# Altium schematic sheet Controllable_voltage_outputs.SchDoc
size A4; SheetNumber: 5; SheetTotal: 6
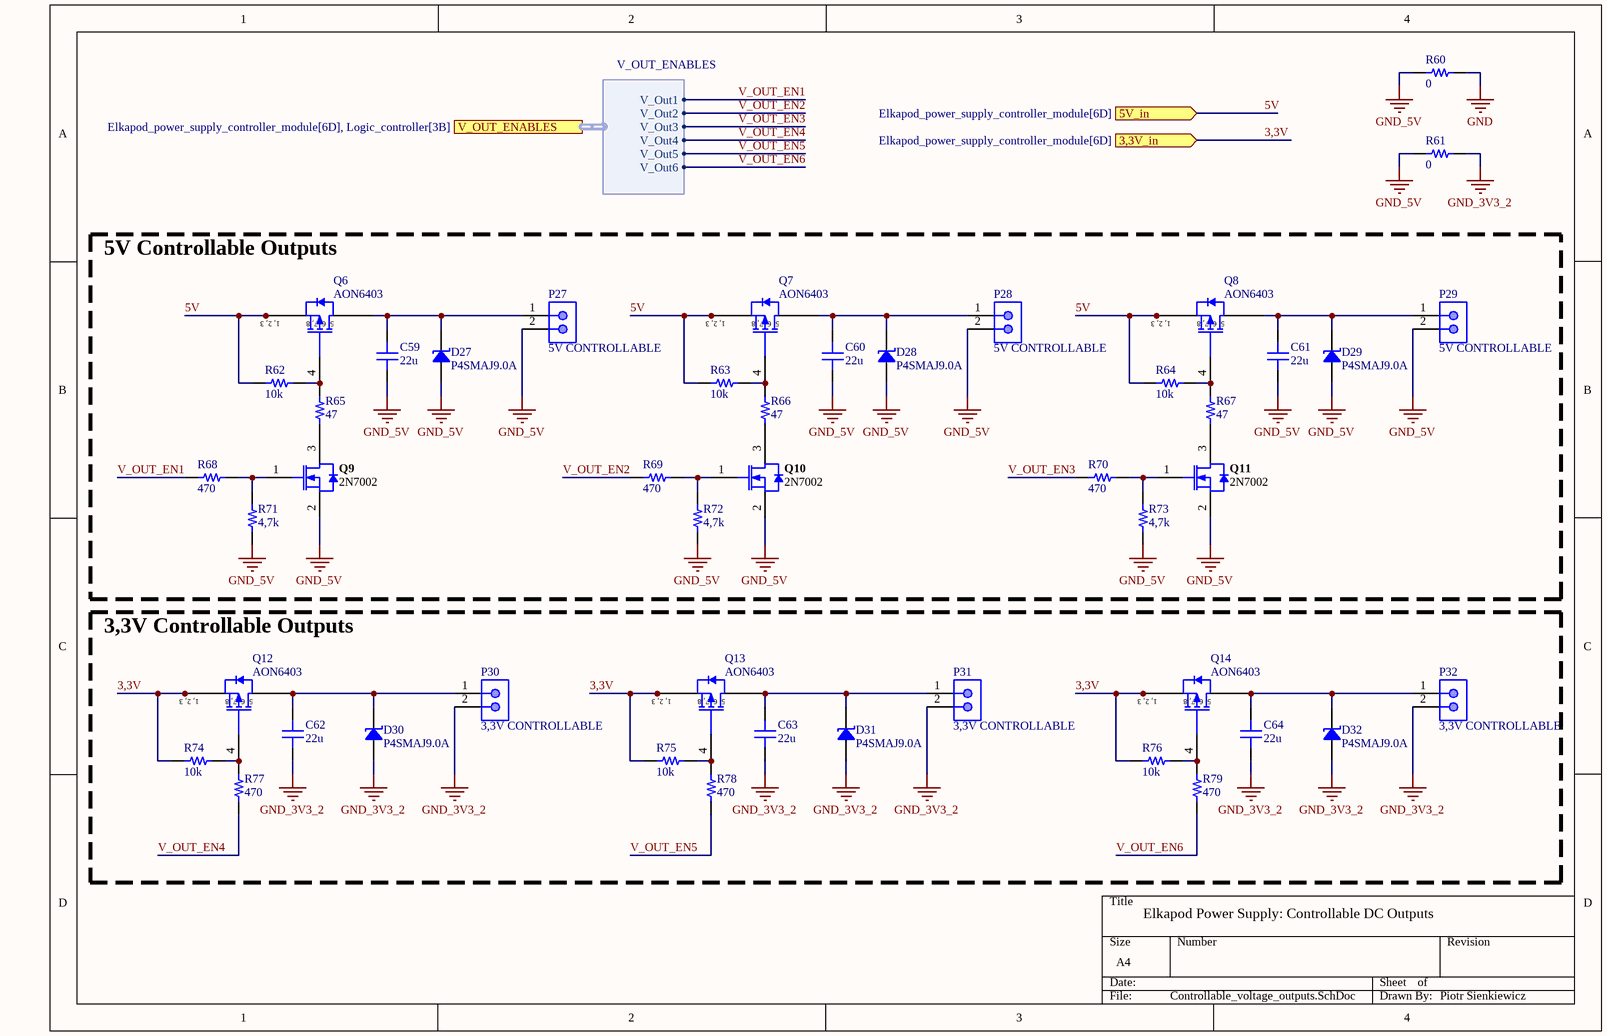
[diagram p0: Controllable_voltage_outputs.SchDoc]

## Parts
C59  22u  [CAP 0805_2012]
C60  22u  [CAP 0805_2012]
C61  22u  [CAP 0805_2012]
C62  22u  [CAP 0805_2012]
C63  22u  [CAP 0805_2012]
C64  22u  [CAP 0805_2012]
D27  P4SMAJ9.0A  [DO214AC SMA]
D28  P4SMAJ9.0A  [DO214AC SMA]
D29  P4SMAJ9.0A  [DO214AC SMA]
D30  P4SMAJ9.0A  [DO214AC SMA]
D31  P4SMAJ9.0A  [DO214AC SMA]
D32  P4SMAJ9.0A  [DO214AC SMA]
P27  5V CONTROLLABLE  [MOLX-22-23-2021_V]
P28  5V CONTROLLABLE  [MOLX-22-23-2021_V]
P29  5V CONTROLLABLE  [MOLX-22-23-2021_V]
P30  3,3V CONTROLLABLE  [MOLX-22-23-2021_V]
P31  3,3V CONTROLLABLE  [MOLX-22-23-2021_V]
P32  3,3V CONTROLLABLE  [MOLX-22-23-2021_V]
Q6  AON6403  [DFN5x6]
Q7  AON6403  [DFN5x6]
Q8  AON6403  [DFN5x6]
Q9  2N7002  [INF-PG-SOT23_M]
Q10  2N7002  [INF-PG-SOT23_M]
Q11  2N7002  [INF-PG-SOT23_M]
Q12  AON6403  [DFN5x6]
Q13  AON6403  [DFN5x6]
Q14  AON6403  [DFN5x6]
R60  0  [RES 0603_1608]
R61  0  [RES 0603_1608]
R62  10k  [RES 0603_1608]
R63  10k  [RES 0603_1608]
R64  10k  [RES 0603_1608]
R65  47  [RES 0603_1608]
R66  47  [RES 0603_1608]
R67  47  [RES 0603_1608]
R68  470  [RES 0603_1608]
R69  470  [RES 0603_1608]
R70  470  [RES 0603_1608]
R71  4,7k  [RES 0603_1608]
R72  4,7k  [RES 0603_1608]
R73  4,7k  [RES 0603_1608]
R74  10k  [RES 0603_1608]
R75  10k  [RES 0603_1608]
R76  10k  [RES 0603_1608]
R77  470  [RES 0603_1608]
R78  470  [RES 0603_1608]
R79  470  [RES 0603_1608]

## Blocks framed on the sheet
5V Controllable Outputs: C59-C61 D27-D29 P27-P29 Q6-Q11 R62-R73
3,3V Controllable Outputs: C62-C64 D30-D32 P30-P32 Q12-Q14 R74-R79

## Ports
3,3V_in (in, see Elkapod_power_supply_controller_module[6D]), 5V_in (in, see Elkapod_power_supply_controller_module[6D]), V_OUT_ENABLES (harness V_OUT_ENABLES, see Elkapod_power_supply_controller_module[6D], Logic_controller[3B])

## Harnesses
V_OUT_ENABLES: V_Out1, V_Out2, V_Out3, V_Out4, V_Out5, V_Out6

## Nets
GND: R60.2
GND_3V3_2: C62.1 C63.1 C64.1 D30.1 D31.1 D32.1 P30.2 P31.2 P32.2 R61.2
GND_5V: C59.1 C60.1 C61.1 D27.1 D28.1 D29.1 P27.2 P28.2 P29.2 Q9.2(SOURCE) Q10.2(SOURCE) Q11.2(SOURCE) R60.1 R61.1 R71.2 R72.2 R73.2
3,3V: Q12.1(S) Q12.2(S) Q12.3(S) Q13.1(S) Q13.2(S) Q13.3(S) Q14.1(S) Q14.2(S) Q14.3(S) R74.1 R75.1 R76.1 ; port 3,3V_in
5V: Q6.1(S) Q6.2(S) Q6.3(S) Q7.1(S) Q7.2(S) Q7.3(S) Q8.1(S) Q8.2(S) Q8.3(S) R62.1 R63.1 R64.1 ; port 5V_in
V_OUT_EN1: R68.2 ; port V_OUT_ENABLES.V_Out1
V_OUT_EN2: R69.2 ; port V_OUT_ENABLES.V_Out2
V_OUT_EN3: R70.2 ; port V_OUT_ENABLES.V_Out3
V_OUT_EN4: R77.2 ; port V_OUT_ENABLES.V_Out4
V_OUT_EN5: R78.2 ; port V_OUT_ENABLES.V_Out5
V_OUT_EN6: R79.2 ; port V_OUT_ENABLES.V_Out6
NetC59_2: C59.2 D27.2 P27.1 Q6.5(D)
NetC60_2: C60.2 D28.2 P28.1 Q7.5(D)
NetC61_2: C61.2 D29.2 P29.1 Q8.5(D)
NetC62_2: C62.2 D30.2 P30.1 Q12.5(D)
NetC63_2: C63.2 D31.2 P31.1 Q13.5(D)
NetC64_2: C64.2 D32.2 P32.1 Q14.5(D)
NetQ6_4: Q6.4(G) R62.2 R65.1
NetQ7_4: Q7.4(G) R63.2 R66.1
NetQ8_4: Q8.4(G) R64.2 R67.1
NetQ9_1: Q9.1(GATE) R68.1 R71.1
NetQ9_3: Q9.3(DRAIN) R65.2
NetQ10_1: Q10.1(GATE) R69.1 R72.1
NetQ10_3: Q10.3(DRAIN) R66.2
NetQ11_1: Q11.1(GATE) R70.1 R73.1
NetQ11_3: Q11.3(DRAIN) R67.2
NetQ12_4: Q12.4(G) R74.2 R77.1
NetQ13_4: Q13.4(G) R75.2 R78.1
NetQ14_4: Q14.4(G) R76.2 R79.1

## Notes on the sheet
- Elkapod Power Supply: Controllable DC Outputs
- Piotr Sienkiewicz
- (in symbol AON6403) 1, 2, 3; 5, 6, 7, 8

## Library data of the parts
C59-C64 = VJ0805Y684KXQTW1BC: CAP CER 22UF 25V X7R 0805; manufacturer: Vishay Vitramon; Tolerance: ±10%; Voltage - Rated: 10V; Part Number: VJ0805Y684KXQTW1BC; Value: 22u; Applications: General Purpose; Capacitance: 22u; componentlink1description: Datasheet; componentlink1url: https://www.vishay.com/docs/28548/vjw1bcbascomseries.pdf; componentlink2description: DigiKey Link; componentlink2url: https://www.digikey.com/en/products/detail/vishay-vitramon/VJ0805Y684KXQTW1BC/8313569; Device Package: 0805 (2012 Metric); lastupdated: 09.02.2024 20:13:13; Lifecycle Status: Active; Minimum Order: 1; Mounting Type: Surface Mount, MLCC; Operating Temperature: -55°C ~ 125°C; Package / Case: 0805 (2012 Metric); packaging: TapeAndReel; partid: 57262; price: 0.05; series: VJ W1BC; Size / Dimension: 0.079" L x 0.049" W (2.00mm x 1.25mm); Temperature Coefficient: X7R; Thickness (Max): 0.053" (1.35mm)
D27-D32 = SMA6J18A-TP: TVS DIODE 9VDC DO214AC; Part Number: P4SMAJ9.0A
P27-P32 = CMP-1704-00001-3: Male Header, Pitch 2.54 mm, 1 x 2 Position, Height 10.67 mm, Tail Length 3.56 mm, 0 to 75 degC, RoHS, Bulk; Package Quantity: 3000; Height: 10.67 mm; RoHSCompliant: True; ComponentLink2URL: https://datasheet.ciiva.com/19454/232266-19454304.pdf; PartNumber: 22-23-2021; Packaging: Bulk; ComponentLink2Description: Datasheet; Min Operating Temperature: 0 degC; ComponentLink1Description: Manufacturer URL; Length: 5.08 mm; Mounting Technology: Through Hole; Max Operating Temperature: 75 degC; REACH SVHC: Unknown; PackageDescription: Male Header, Pitch 2.54 mm, 1 x 2 Position, Height 10.67 mm, Tail Length 3.56 mm; ComponentLink1URL: http://www.molex.com/; Mount: Through Hole; Radiation Hardening: No; Width: 6.35 mm; Pins: 2
Q6-Q8 Q12-Q14 = AON6403: P-MOSFET; 67A; 30V; DFN5x6
Q9-Q11 = CMP-1149-00026-1: N-Channel OptiMOS Small-Signal-Transistor, 60 V VDS, 0.3 A ID, -55 to 150 degC, PG-SOT23, Reel, Green; Manufacturer: Infineon; RDS (on) (max) (@4.5V): 4,000 mOhm; VDS (max): 60 V; IDpuls (max): 1.2Â A; QG: 0.4Â nC; RDS (on) (max): 3,000 mOhm; RthJA (max): 250 K/W; ID (max): 0.3Â A; VGS(th) (max): 2.5Â V; VGS(th) (min): 1.5Â V; Green: TRUE; Ptot (max): 0.5Â W; PackageDescription: 3-Pin Small Outline Transistor Package, 2.9 x 1.3 mm Body, 0.95 mm Pitch; Halogen-free: TRUE; ComponentLink2Description: Datasheet; ComponentLink1URL: http://www.infineon.com/; Packing: Reel; DatasheetVersion: Rev. 2.4; PartNumber: 2N7002; PackageReference: PG-SOT23; PackageVersion: Apr-08; ComponentLink3URL: http://www.infineon.com/dgdl/SOT23-Package_Overview.pdf?folderId=db3a30431936bc4b0119532290053c66&fileId=db3a30431936bc4b0119533468123c85; ComponentLink1Description: Manufacturer URL; Mounting Technology: Surface Mount; ComponentLink3Description: Package Specification; ComponentLink2URL: http://www.infineon.com/dgdl/2N7002_Rev2.4.pdf?folderId=db3a3043156fd573011622e10b5c1f67&fileId=db3a304319bc939a0119c2a9461e79e6
R60 R61 = RNCS0603BKE10K0: RES 0 OHM 1% 0,1W 0603; Manufacturer: Stackpole Electronics Inc; Power (Watts): 0.063W, 1/16W; Temperature Coefficient: ±25ppm/°C; Tolerance: ±0.1%; Part Number: RNCS0603BKE10K0; Value: 0; Composition: Thin Film; Device Package: 0603 (1608 Metric); Features: Anti-Corrosive, Automotive AEC-Q200, Moisture Resistant; Height - Seated (Max): 0.022" (0.55mm); LastUpdated: 09.02.2024 20:43:37; Lifecycle Status: Active; Minimum Order: 1; Number of Terminations: 2; Operating Temperature: -55°C ~ 155°C; Package / Case: 0603 (1608 Metric); Packaging: TapeAndReel; PartId: 4838; Part Status: Active; Price: 0.06; Ratings: AEC-Q200; Resistance: 0; Series: RNCS; Size / Dimension: 0.061" L x 0.031" W (1.55mm x 0.80mm); Supplier Device Package: 0603
R62-R64 R74-R76 = RNCS0603BKE10K0: RES 10K OHM 1% 0,1W 0603; Manufacturer: Stackpole Electronics Inc; Power (Watts): 0.063W, 1/16W; Temperature Coefficient: ±25ppm/°C; Tolerance: ±0.1%; Part Number: RNCS0603BKE10K0; Value: 10k; Composition: Thin Film; Device Package: 0603 (1608 Metric); Features: Anti-Corrosive, Automotive AEC-Q200, Moisture Resistant; Height - Seated (Max): 0.022" (0.55mm); LastUpdated: 09.02.2024 20:43:37; Lifecycle Status: Active; Minimum Order: 1; Number of Terminations: 2; Operating Temperature: -55°C ~ 155°C; Package / Case: 0603 (1608 Metric); Packaging: TapeAndReel; PartId: 4838; Part Status: Active; Price: 0.06; Ratings: AEC-Q200; Resistance: 10k; Series: RNCS; Size / Dimension: 0.061" L x 0.031" W (1.55mm x 0.80mm); Supplier Device Package: 0603
R65-R67 = RNCS0603BKE10K0: RES 47 OHM 1% 0,1W 0603; Manufacturer: Stackpole Electronics Inc; Power (Watts): 0.063W, 1/16W; Temperature Coefficient: ±25ppm/°C; Tolerance: ±0.1%; Part Number: RNCS0603BKE10K0; Value: 47; Composition: Thin Film; Device Package: 0603 (1608 Metric); Features: Anti-Corrosive, Automotive AEC-Q200, Moisture Resistant; Height - Seated (Max): 0.022" (0.55mm); LastUpdated: 09.02.2024 20:43:37; Lifecycle Status: Active; Minimum Order: 1; Number of Terminations: 2; Operating Temperature: -55°C ~ 155°C; Package / Case: 0603 (1608 Metric); Packaging: TapeAndReel; PartId: 4838; Part Status: Active; Price: 0.06; Ratings: AEC-Q200; Resistance: 47; Series: RNCS; Size / Dimension: 0.061" L x 0.031" W (1.55mm x 0.80mm); Supplier Device Package: 0603
R68-R70 R77-R79 = RNCS0603BKE10K0: RES 470 OHM 1% 0,1W 0603; Manufacturer: Stackpole Electronics Inc; Power (Watts): 0.063W, 1/16W; Temperature Coefficient: ±25ppm/°C; Tolerance: ±0.1%; Part Number: RNCS0603BKE10K0; Value: 470; Composition: Thin Film; Device Package: 0603 (1608 Metric); Features: Anti-Corrosive, Automotive AEC-Q200, Moisture Resistant; Height - Seated (Max): 0.022" (0.55mm); LastUpdated: 09.02.2024 20:43:37; Lifecycle Status: Active; Minimum Order: 1; Number of Terminations: 2; Operating Temperature: -55°C ~ 155°C; Package / Case: 0603 (1608 Metric); Packaging: TapeAndReel; PartId: 4838; Part Status: Active; Price: 0.06; Ratings: AEC-Q200; Resistance: 470; Series: RNCS; Size / Dimension: 0.061" L x 0.031" W (1.55mm x 0.80mm); Supplier Device Package: 0603
R71-R73 = RNCS0603BKE10K0: RES 4,7K OHM 1% 0,1W 0603; Manufacturer: Stackpole Electronics Inc; Power (Watts): 0.063W, 1/16W; Temperature Coefficient: ±25ppm/°C; Tolerance: ±0.1%; Part Number: RNCS0603BKE10K0; Value: 4,7k; Composition: Thin Film; Device Package: 0603 (1608 Metric); Features: Anti-Corrosive, Automotive AEC-Q200, Moisture Resistant; Height - Seated (Max): 0.022" (0.55mm); LastUpdated: 09.02.2024 20:43:37; Lifecycle Status: Active; Minimum Order: 1; Number of Terminations: 2; Operating Temperature: -55°C ~ 155°C; Package / Case: 0603 (1608 Metric); Packaging: TapeAndReel; PartId: 4838; Part Status: Active; Price: 0.06; Ratings: AEC-Q200; Resistance: 4,7k; Series: RNCS; Size / Dimension: 0.061" L x 0.031" W (1.55mm x 0.80mm); Supplier Device Package: 0603